# EAGLE design generic_midi_1 (EAGLE 7.1.0)
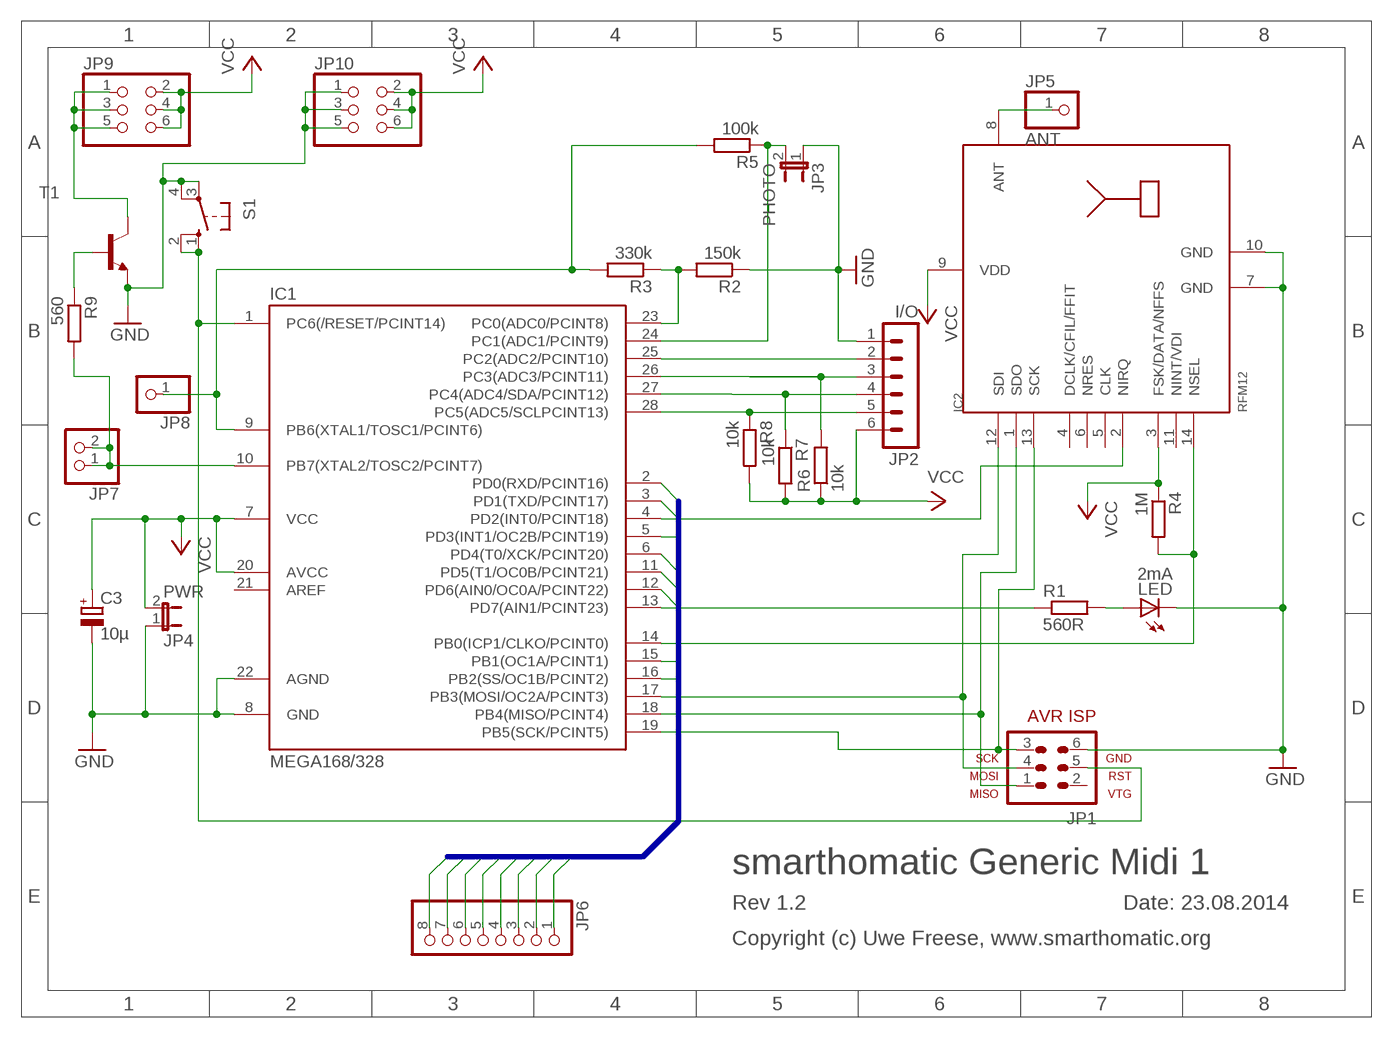
[diagram p0: schematic, sheet 1]

## Parts
C3  10µ  CPOL-EUE1.8-4  [E1,8-4]
IC1  MEGA168/328  MEGA48/88/168-PU  [DIL28-3]
IC2  RFM12  [RFM]
JP1  AVR-ISP-6  [AVR-ISP-6]
JP2  I/O  MA06-1  [MA06-1]
JP3  PHOTO  JP1E  [JP1]
JP4  PWR  JP1E  [JP1]
JP5  ANT  PINHD-1X1  [1X01]
JP6  PINHD-1X8  [1X08]
JP7  PINHD-1X2  [1X02]
JP8  PINHD-1X1  [1X01]
JP9  PINHD-2X3  [2X03]
JP10  PINHD-2X3  [2X03]
LED  2mA  LED3MM  [LED3MM]
R1  560R  R-EU_0207/7  [0207/7]
R2  150k  R-EU_0207/7  [0207/7]
R3  330k  R-EU_0207/7  [0207/7]
R4  1M  R-EU_0207/7  [0207/7]
R5  100k  R-EU_0207/7  [0207/7]
R6  10k  R-EU_0207/7  [0207/7]
R7  10k  R-EU_0207/7  [0207/7]
R8  10k  R-EU_0207/7  [0207/7]
R9  560  R-EU_0207/7  [0207/7]
S1  10-XX  [B3F-10XX]
T1  BC547-NPN-TO92-CBE  [TO92-CBE]

## Nets
GND: C3.- IC1.8(GND) IC1.22(AGND) IC2.7(GND) IC2.10(GND) JP1.6 JP2.1 JP3.1 JP4.1 JP10.1 JP10.3 JP10.5 LED.K(C) R2.1 S1.3(P) S1.4(P1) T1.E
IO0: IC1.3(PD1(TXD/PCINT17)) JP6.1
IO1: IC1.2(PD0(RXD/PCINT16)) JP6.2
IO2: IC1.5(PD3(INT1/OC2B/PCINT19)) JP6.3
IO3: IC1.6(PD4(T0/XCK/PCINT20)) JP6.4
IO4: IC1.11(PD5(T1/OC0B/PCINT21)) JP6.5
IO5: IC1.12(PD6(AIN0/OC0A/PCINT22)) JP6.6
IO6: IC1.15(PB1(OC1A/PCINT1)) JP6.7
IO7: IC1.16(PB2(SS/OC1B/PCINT2)) JP6.8
N$1: IC1.24(PC1(ADC1/PCINT9)) JP3.2 R5.1
N$3: IC1.17(PB3(MOSI/OC2A/PCINT3)) IC2.12(SDI) JP1.4
N$4: IC1.18(PB4(MISO/PCINT4)) IC2.1(SDO) JP1.1
N$5: IC1.19(PB5(SCK/PCINT5)) IC2.13(SCK) JP1.3
N$6: IC1.13(PD7(AIN1/PCINT23)) R1.1
N$7: IC1.27(PC4(ADC4/SDA/PCINT12)) JP2.4 R7.1
N$8: IC1.1(PC6(/RESET/PCINT14)) JP1.5 S1.1(S) S1.2(S1)
N$9: IC1.28(PC5(ADC5/SCLPCINT13)) JP2.5 R8.1
N$10: IC1.26(PC3(ADC3/PCINT11)) JP2.3 R6.2
N$11: IC2.8(ANT) JP5.1
N$12: LED.A R1.2
N$13: IC1.14(PB0(ICP1/CLKO/PCINT0)) IC2.14(NSEL) R4.2
N$14: IC1.10(PB7(XTAL2/TOSC2/PCINT7)) JP7.1 JP7.2 R9.2
N$15: IC1.4(PD2(INT0/PCINT18)) IC2.2(NIRQ)
N$16: JP9.1 JP9.3 JP9.5 T1.C
N$17: R9.1 T1.B
N$18: IC1.23(PC0(ADC0/PCINT8)) R2.2 R3.1
N$21: IC1.25(PC2(ADC2/PCINT10)) JP2.2
N$24: IC1.9(PB6(XTAL1/TOSC1/PCINT6)) JP8.1 R3.2 R5.2
VCC: C3.+ IC1.7(VCC) IC1.20(AVCC) IC2.3(FSK/DATA/NFFS) IC2.9(VDD) JP2.6 JP4.2 JP9.2 JP9.4 JP9.6 JP10.2 JP10.4 JP10.6 R4.1 R6.1 R7.2 R8.2
Unconnected: IC1.21(AREF) IC2.4(DCLK/CFIL/FFIT) IC2.5(CLK) IC2.6(NRES) IC2.11(NINT/VDI) JP1.2

## Buses
IO[0..7]

## Notes on the sheet
- smarthomatic Generic Midi 1
- Rev 1.2 | Date: 23.08.2014
- Copyright (c) Uwe Freese, www.smarthomatic.org

## Library data of the parts
C3 = rcl:CPOL-EU: POLARIZED CAPACITOR, European symbol
IC1 = avr-5-4.16:MEGA48/88/168-PU
IC2 = hopeRF:RFM12
JP1 = avr-5-4.16:AVR-ISP-6: AVR ISP-6 Serial Programming Header
JP2 = con-lstb:MA06-1: PIN HEADER; OC_FARNELL: unknown; OC_NEWARK: unknown
JP3 JP4 = jumper:JP1E: JUMPER
JP5 JP8 = pinhead:PINHD-1X1: PIN HEADER
JP6 = pinhead:PINHD-1X8: PIN HEADER
JP7 = pinhead:PINHD-1X2: PIN HEADER
JP9 JP10 = pinhead:PINHD-2X3: PIN HEADER
LED = led:LED: LED OSRAM: - CHIPLED LG R971, LG N971, LY N971, LG Q971, LY Q971, LO R971, LY R971 LH N974, LH R974 LS Q976, LO Q976, LY Q976 LO Q996 - Hyper CHIPLED LW Q18S LB Q993, LB Q99A, LB R99A - SideLED LS A670, LO A670, LY A670, LG A670, LP A670 LB A673, LV A673, LT A673, LW A673 LH A674 LY A675 LS A676, LA A676, LO A676, LY A676, LW A676 LS A679, LY A679, LG A679 - Hyper Micro SIDELED® LS Y876, LA Y876, LO Y876, LY Y876 LT Y87S - SmartLED LW L88C, LW L88S LB L89C, LB L89S, LG L890 LS L89K, LO L89K, LY L89K LS L896, LA L896, LO L896, LY L896 - TOPLED LS T670, LO T670, LY T670, LG T670, LP T670 LSG T670, LSP T670, LSY T670, LOP T670, LYG T670 LG T671, LOG T671, LSG T671 LB T673, LV T673, LT T673, LW T673 LH T674 LS T676, LA T676, LO T676, LY T676, LB T676, LH T676, LSB T676, LW T676 LB T67C, LV T67C, LT T67C, LS T67K, LO T67K, LY T67K, LW E67C LS E67B, LA E67B, LO E67B, LY E67B, LB E67C, LV E67C, LT E67C LW T67C LS T679, LY T679, LG T679 LS T770, LO T770, LY T770, LG T770, LP T770 LB T773, LV T773, LT T773, LW T773 LH T774 LS E675, LA E675, LY E675, LS T675 LS T776, LA T776, LO T776, LY T776, LB T776 LHGB T686 LT T68C, LB T68C - Hyper Mini TOPLED® LB M676 - Mini TOPLED Santana® LG M470 LS M47K, LO M47K, LY M47K Source: http://www.osram.convergy.de LUXEON: - LUMILED® LXK2-PW12-R00, LXK2-PW12-S00, LXK2-PW14-U00, LXK2-PW14-V00 LXK2-PM12-R00, LXK2-PM12-S00, LXK2-PM14-U00 LXK2-PE12-Q00, LXK2-PE12-R00, LXK2-PE12-S00, LXK2-PE14-T00, LXK2-PE14-U00 LXK2-PB12-K00, LXK2-PB12-L00, LXK2-PB12-M00, LXK2-PB14-N00, LXK2-PB14-P00, LXK2-PB14-Q00 LXK2-PR12-L00, LXK2-PR12-M00, LXK2-PR14-Q00, LXK2-PR14-R00 LXK2-PD12-Q00, LXK2-PD12-R00, LXK2-PD12-S00 LXK2-PH12-R00, LXK2-PH12-S00 LXK2-PL12-P00, LXK2-PL12-Q00, LXK2-PL12-R00 Source: www.luxeon.com KINGBRIGHT: KA-3528ASYC Source: www.kingbright.com
R1-R9 = rcl:R-EU_: RESISTOR, European symbol
S1 = switch-omron:10-XX: OMRON SWITCH; MPN: B3F-1000; OC_FARNELL: 176432; OC_NEWARK: 36M3542
T1 = transistor:*-NPN-: NPN Transistror BF959 corrected 2008.03.06

## Net classes
0 default: clearance 0.305 mm

## Board
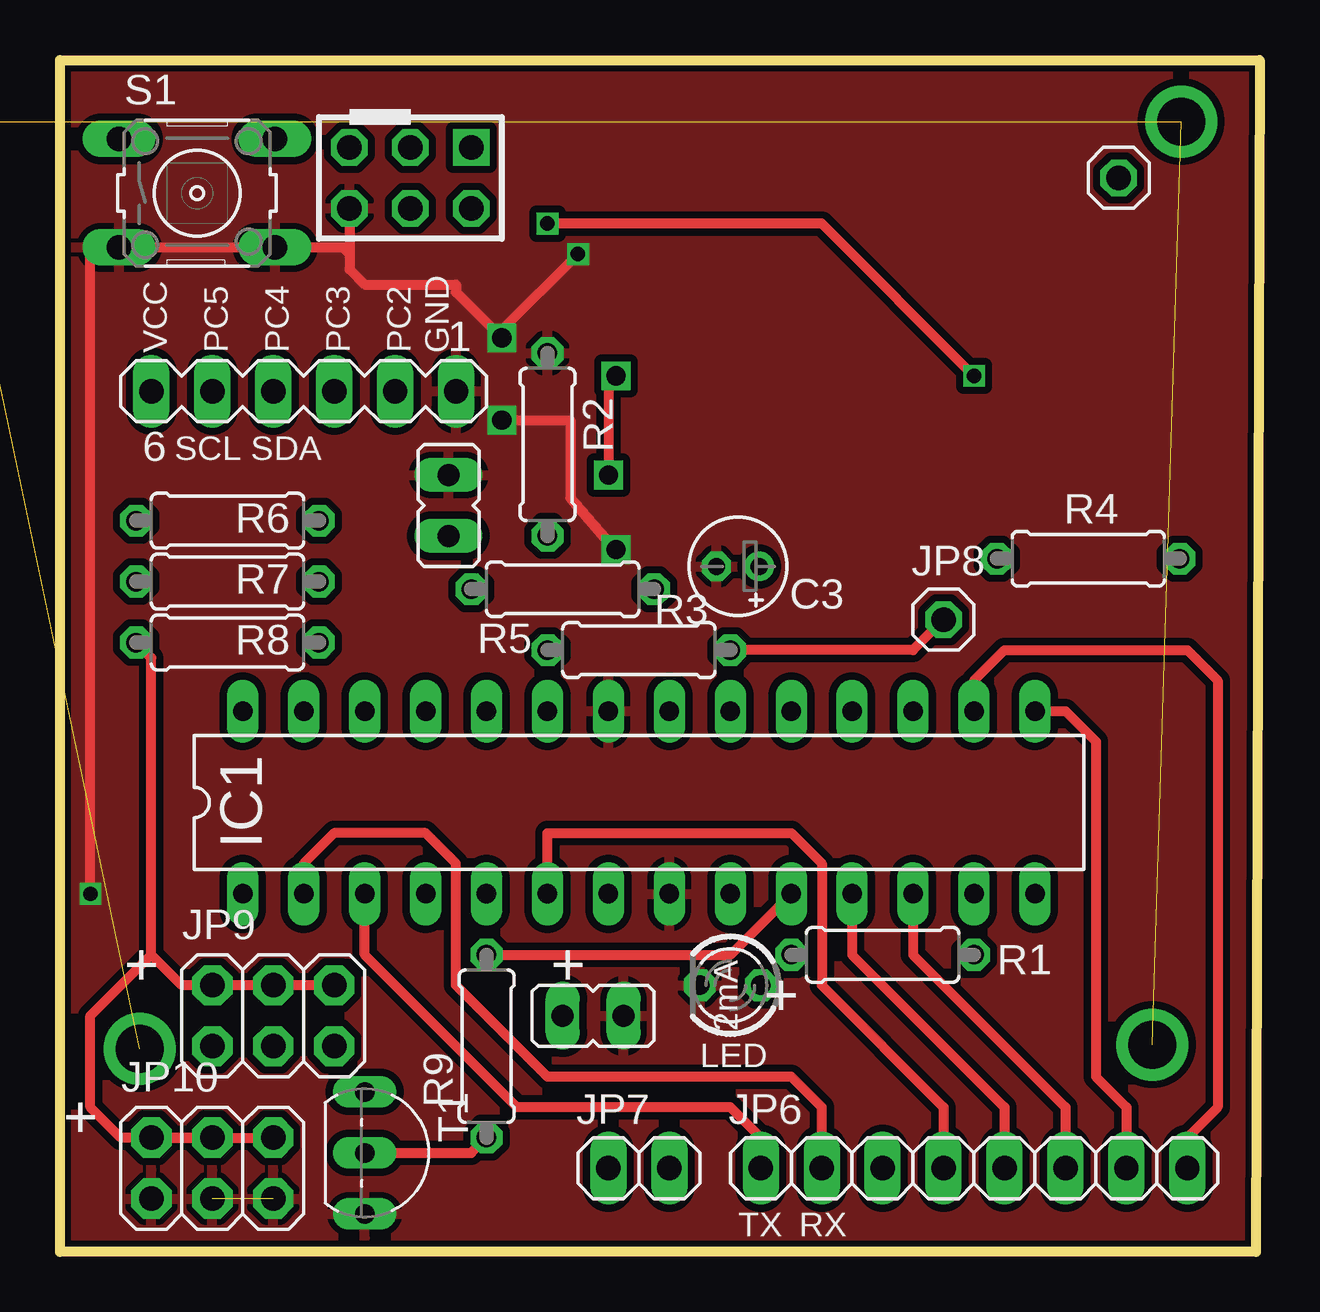
[diagram p1: board, top side]
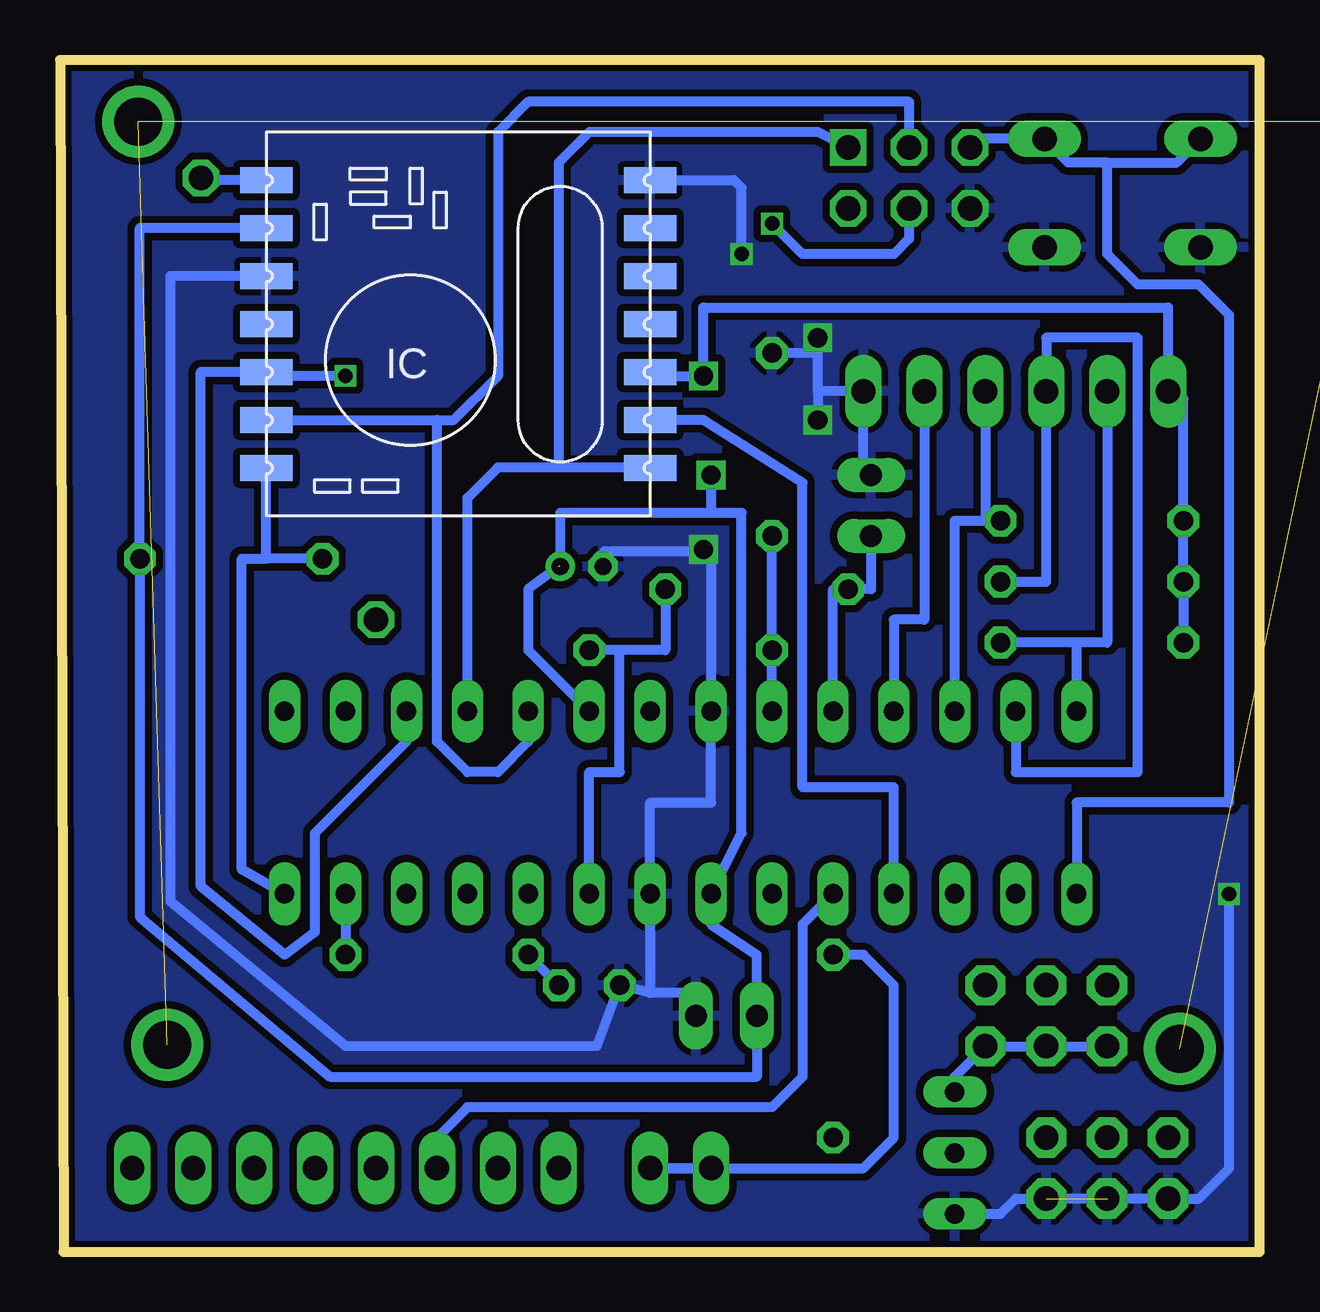
[diagram p2: board, bottom side, seen from below]

Size 50 x 49.68 mm. Coordinates in mm from the lower left corner, seen from the top.
Outline: 0,0 0,49.68 50,49.68 49.85,0 0,0
Copper layers (1*16): Top 0.035mm / dielectric 1.5mm / Bottom 0.035mm
Design rules "ITEADstudio_DRC": minimum track width 6mil, minimum drill 12mil, track to track 6mil, track to pad 6mil, pad to pad 6mil, via to via 6mil, smd to smd 0mil, copper to edge 10mil, drill to drill 10mil, minimum pad ring 10mil, minimum via ring 6mil, stop-mask expansion 2mil, vias tented up to drill 100mil, thermal gap 10mil

### Footprints (pad centres in the part's own frame; a part is rotated, then mirrored left to right if it is on the bottom)
E1,8-4 = drill 0.711 pad 1.168: + -0.889,0 | drill 0.711 pad 1.168 octagon: - 0.889,0
DIL28-3 = drill 0.813 long: 1 -16.51,-3.81; 2 -13.97,-3.81; 3 -11.43,-3.81; 4 -8.89,-3.81; 5 -6.35,-3.81; 6 -3.81,-3.81; 7 -1.27,-3.81; 8 1.27,-3.81; 9 3.81,-3.81; 10 6.35,-3.81; 11 8.89,-3.81; 12 11.43,-3.81; 13 13.97,-3.81; 14 16.51,-3.81; 15 16.51,3.81; 16 13.97,3.81; 17 11.43,3.81; 18 8.89,3.81; 19 6.35,3.81; 20 3.81,3.81; 21 1.27,3.81; 22 -1.27,3.81; 23 -3.81,3.81; 24 -6.35,3.81; 25 -8.89,3.81; 26 -11.43,3.81; 27 -13.97,3.81; 28 -16.51,3.81
RFM = smd 2.184 x 1.067: 1 0,14; 2 0,12; 3 0,10; 4 0,8; 5 0,6; 6 0,4; 7 0,2; 8 16,2; 9 16,4; 10 16,6; 11 16,8; 12 16,10; 13 16,12; 14 16,14
AVR-ISP-6 = drill 1.016 square: 1 -2.54,-1.27 | drill 1.016 octagon: 2 -2.54,1.27; 3 0,-1.27; 4 0,1.27; 5 2.54,-1.27; 6 2.54,1.27
MA06-1 = drill 1.016 long: 1 -6.35,0; 2 -3.81,0; 3 -1.27,0; 4 1.27,0; 5 3.81,0; 6 6.35,0
JP1 = drill 0.914 long: 1 0,-1.27; 2 0,1.27
1X01 = drill 1.016 octagon: 1 0,0
1X08 = drill 1.016 long: 1 -8.89,0; 2 -6.35,0; 3 -3.81,0; 4 -1.27,0; 5 1.27,0; 6 3.81,0; 7 6.35,0; 8 8.89,0
1X02 = drill 1.016 long: 1 -1.27,0; 2 1.27,0
2X03 = drill 1.016 pad 1.676 octagon: 1 -2.54,-1.27; 2 -2.54,1.27; 3 0,-1.27; 4 0,1.27; 5 2.54,-1.27; 6 2.54,1.27
LED3MM = drill 0.813 octagon: A -1.27,0; K 1.27,0
0207/7 = drill 0.813 octagon: 1 -3.81,0; 2 3.81,0
B3F-10XX = drill 1.016 long: 1 -3.251,2.261; 2 3.251,2.261; 3 -3.251,-2.261; 4 3.251,-2.261
TO92-CBE = drill 0.813 long: B 0,0; C -2.54,0; E 2.54,0

### Placement (x,y rotation side)
C3  28.26,28.57 180 top
IC1  24.13,18.73 0 top
IC2  25.4,46.67 180 bottom
JP1  14.61,44.77 180 top
JP2  10.16,35.88 180 top
JP3  16.19,31.12 180 top
JP4  22.23,9.84 90 top
JP5  44.13,44.77 0 top
JP6  38.1,3.49 0 top
JP7  24.13,3.49 0 top
JP8  36.83,26.35 0 top
JP9  8.89,9.84 0 top
JP10  6.35,3.49 0 top
LED  27.94,11.11 180 top
R1  34.29,12.38 180 top
R2  20.32,33.65 270 top
R3  24.13,25.08 0 top
R4  42.86,28.89 180 top
R5  20.95,27.62 0 top
R6  6.99,30.48 0 top
R7  6.99,27.94 180 top
R8  6.99,25.4 180 top
R9  17.78,8.57 90 top
S1  5.71,44.13 0 top
T1  12.7,4.13 270 top

### Tracks (layer width: path | path; a pad name or v marks a point on that pad's centre or on a via)
GND  (via drill 0.6, 0.8)  (1 unrouted)
  Top 0.406: v18.41,34.67 21.27,34.67 21.27,31.43 23.18,29.21 v23.18,29.27 | v21.59,41.59 18.41,38.42 v18.41,38.1 16.51,40 16.51,40.32 12.7,40.32 12.06,40.96 12.06,41.59 | JP1.6 12.06,41.59 | v1.27,14.92 1.27,41.59 2.18,41.59 S1.3 S1.4 11.79,41.87 12.06,41.59
  Bottom 0.406: IC2.10 45.4,40.67 45.4,14.6 38.1,8.57 27.62,8.57 LED.K 25.4,10.8 | 22.86,29.21 IC1.22 22.86,18.73 25.4,18.73 IC1.8 25.4,10.8 | IC2.7 21.91,44.67 21.59,44.35 v21.59,41.59 | 18.41,35.88 JP2.1 16.51,32.39 JP3.1 | C3.- 27.3,28.57 27.3,29.21 22.86,29.21 | 22.86,29.21 v23.18,29.27 | 18.41,37.46 R2.1 | 18.41,35.88 18.41,37.46 | 18.41,35.88 v18.41,34.67 | v18.41,38.1 18.41,37.46 | JP4.1 23.5,10.8 25.4,10.8 | v1.27,14.92 1.27,3.49 2.54,2.22 JP10.1 JP10.5 10.16,2.22 10.79,1.59 T1.E
  pour Bottom: 0,49.21 0,-0.32 49.53,-0.32 49.53,50.48 0,50.48
  pour Top: 0,49.21 0,-0.32 49.53,-0.32 49.53,50.48 0,50.48
IO0
  Top 0.406: JP6.1 29.21,4.76 27.94,6.03 19.05,6.03 12.7,12.38 IC1.3
IO1
  Top 0.406: JP6.2 31.75,6.03 30.48,7.3 20.32,7.3 16.51,11.11 16.51,16.19 15.24,17.46 11.43,17.46 10.16,16.19 IC1.2
IO2
  Bottom 0.406: IC1.5 19.05,13.65 19.05,7.3 20.32,6.03 33.02,6.03 34.29,4.76 JP6.3
IO3
  Top 0.406: IC1.6 20.32,17.46 30.48,17.46 31.75,16.19 31.75,11.11 36.83,6.03 JP6.4
IO4
  Top 0.406: IC1.11 33.02,12.38 39.37,6.03 JP6.5
IO5
  Top 0.406: IC1.12 35.56,12.38 41.91,6.03 JP6.6
IO6
  Top 0.406: IC1.15 41.91,22.54 43.18,21.27 43.18,7.3 44.45,6.03 JP6.7
IO7
  Top 0.406: IC1.16 38.1,23.81 39.37,25.08 46.99,25.08 48.26,23.81 48.26,6.03 46.99,4.76 JP6.8
N$1
  Bottom 0.406: JP3.2 16.19,27.62 R5.1 17.78,27.62 IC1.24
N$2  (via drill 2)  (3 unrouted)
  other vias: 46.74,47.12 45.53,8.64 3.32,8.47
N$3  (via drill 0.6)
  Top 0.406: v38.1,36.51 31.75,42.86 v20.32,42.86
  Bottom 0.406: JP1.4 14.61,42.23 15.24,41.59 19.05,41.59 v20.32,42.86 | v38.1,36.51 41.24,36.51 IC2.12 44.13,36.67 44.13,15.24 40.64,12.38 39.37,13.33 39.37,17.46 35.56,21.27 IC1.17
N$4
  Bottom 0.406: JP1.1 18.41,46.67 27.94,46.67 29.21,45.4 29.21,32.7 | IC2.1 25.4,32.7 29.21,32.7 | 29.21,32.7 31.75,32.7 33.02,31.43 IC1.18
N$5
  Bottom 0.406: JP1.3 14.61,47.94 30.48,47.94 31.75,46.67 31.75,36.51 33.59,34.67 34.29,34.67 | IC2.13 34.29,34.67 | IC1.19 30.48,21.27 31.75,20 33.02,20 34.29,21.27 34.29,34.67
N$6
  Bottom 0.406: IC1.13 R1.1
N$7
  Bottom 0.406: R7.1 8.89,27.94 JP2.4 8.89,38.1 5.08,38.1 5.08,20 10.16,20 IC1.27
N$8
  Bottom 0.406: IC1.1 7.62,18.73 1.27,18.73 1.27,39.05 2.54,40.32 5.08,40.32 6.35,41.59 6.35,45.4 | 6.35,45.4 7.98,45.4 S1.2 11.71,46.39 JP1.5 | 6.35,45.4 3.45,45.4 S1.1
N$9
  Bottom 0.406: IC1.28 7.62,25.4 | 7.62,25.4 R8.1 | JP2.5 6.35,25.4 7.62,25.4
N$10
  Bottom 0.406: JP2.3 11.43,30.48 | 11.43,30.48 R6.2 | IC1.26 12.7,30.48 11.43,30.48
N$11
  Bottom 0.406: IC2.8 44.13,44.67 JP5.1
N$12
  Bottom 0.406: LED.A R1.2
N$13
  Bottom 0.406: IC1.14 42.42,15.94 42.42,28.89 41.4,28.89 | R4.2 41.4,28.89 | 41.4,28.89 IC2.14
N$14
  Top 0.406: R9.2 27.94,12.38 IC1.10
  Bottom 0.406: JP7.1 JP7.2 16.51,3.49 15.24,4.76 15.24,11.11 16.51,12.38 R9.2
N$15
  Bottom 0.406: IC1.4 15.24,19.37 19.05,19.37 19.05,32.07 23.18,34.67 IC2.2
N$16
  Bottom 0.406: JP9.1 JP9.3 JP9.5 12.7,7.3 T1.C
N$17
  Top 0.406: T1.B 17.14,4.13 R9.1
N$18
  Bottom 0.406: IC1.23 R3.1 R2.2
N$21
  Bottom 0.406: IC1.25 15.24,26.35 13.97,26.35 JP2.2
N$24
  Top 0.406: JP8.1 35.56,25.08 R3.2
  Bottom 0.406: IC1.9 27.94,20 26.67,20 26.67,25.08 | 26.67,25.08 R3.2 | R5.2 24.77,25.08 26.67,25.08
VCC  (via drill 0.8)  (1 unrouted)
  Top 0.406: v23.18,36.51 22.86,36.51 v22.86,32.39 | R8.2 3.81,24.76 3.81,12.38 | 3.81,12.38 5.08,11.11 JP9.2 JP9.4 JP9.6 | JP10.2 JP10.4 | JP10.4 JP10.6 | JP10.4 2.54,4.76 1.27,6.03 1.27,9.84 3.81,12.38
  Bottom 0.406: IC2.3 25.4,36.51 v23.18,36.51 23.18,39.37 3.81,39.37 JP2.6 3.17,35.56 R6.1 R7.2 R8.2 | IC2.9 46.67,42.67 R4.1 46.67,13.97 38.73,7.3 20.95,7.3 JP4.2 20.95,12.38 22.86,13.65 IC1.7 21.59,17.46 21.59,30.8 22.86,30.8 | 22.86,30.8 29.15,30.8 C3.+ | IC1.20 30.48,25.08 30.48,27.62 29.21,28.57 | v22.86,32.39 22.86,30.8

### Text on the board
tNames: VCC | PC5 | PC4 | PC3 | PC2 | GND | SCL | SDA | + | + | 2mA | + | + | TX | RX